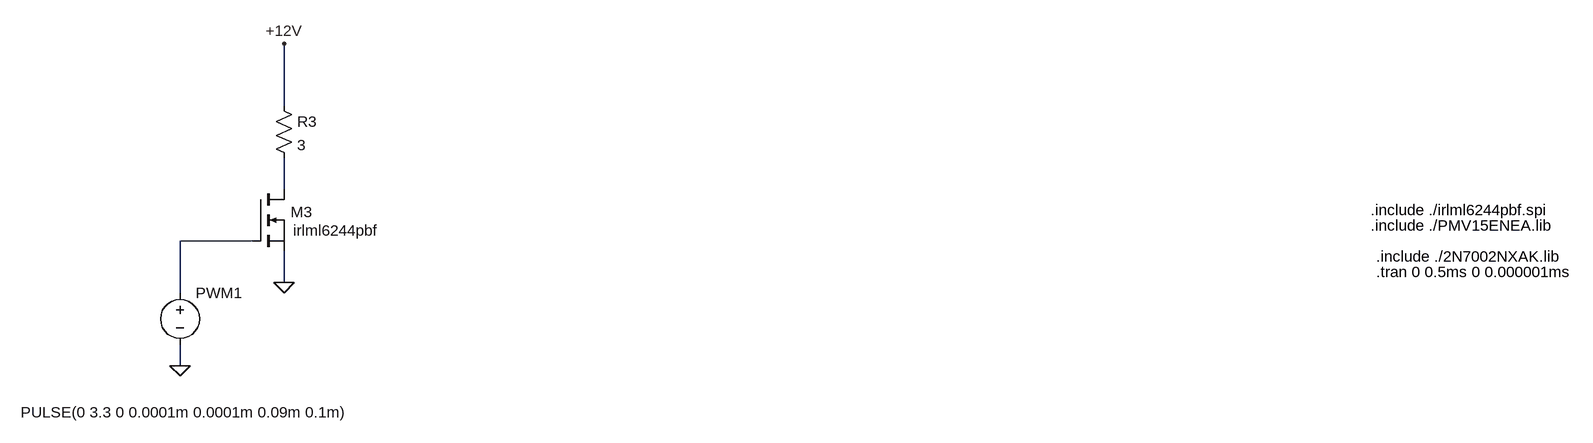
[diagram p0: schematic sim.asc]
sim.asc, the LTspice schematic file:
Version 4
SHEET 1 1652 680
WIRE -416 -176 -416 -272
WIRE -416 -48 -416 -96
WIRE -464 32 -576 32
WIRE -416 96 -416 48
WIRE -576 112 -576 32
WIRE -576 224 -576 192
FLAG -416 -272 +12V
FLAG -416 96 0
FLAG -576 224 0
SYMBOL nmos -464 -48 R0
WINDOW 0 58 35 Left 2
WINDOW 3 62 64 Left 2
SYMATTR InstName M3
SYMATTR Value irlml6244pbf
SYMATTR Prefix X
SYMBOL res -432 -192 R0
SYMATTR InstName R3
SYMATTR Value 3
SYMBOL voltage -576 96 R0
WINDOW 123 0 0 Left 0
WINDOW 39 0 0 Left 0
WINDOW 3 -245 200 Left 2
SYMATTR InstName PWM1
SYMATTR Value PULSE(0 3.3 0 0.0001m 0.0001m 0.09m 0.1m)
TEXT 1256 -16 Left 2 !.include ./irlml6244pbf.spi
TEXT 1264 80 Left 2 !.tran 0 0.5ms 0 0.000001ms
TEXT 1264 56 Left 2 !.include ./2N7002NXAK.lib
TEXT 1256 8 Left 2 !.include ./PMV15ENEA.lib

The netlist it stands for:
* sim.asc
XM3 N001 N002 0 irlml6244pbf  ; pins D G S
R3 +12V N001 3
V§PWM1 N002 0 PULSE(0 3.3 0 0.0001m 0.0001m 0.09m 0.1m)
.include ./irlml6244pbf.spi
.tran 0 0.5ms 0 0.000001ms
.include ./2N7002NXAK.lib
.include ./PMV15ENEA.lib
.backanno
.end